# EAGLE design ESPRobotCar (EAGLE 9.6.2)
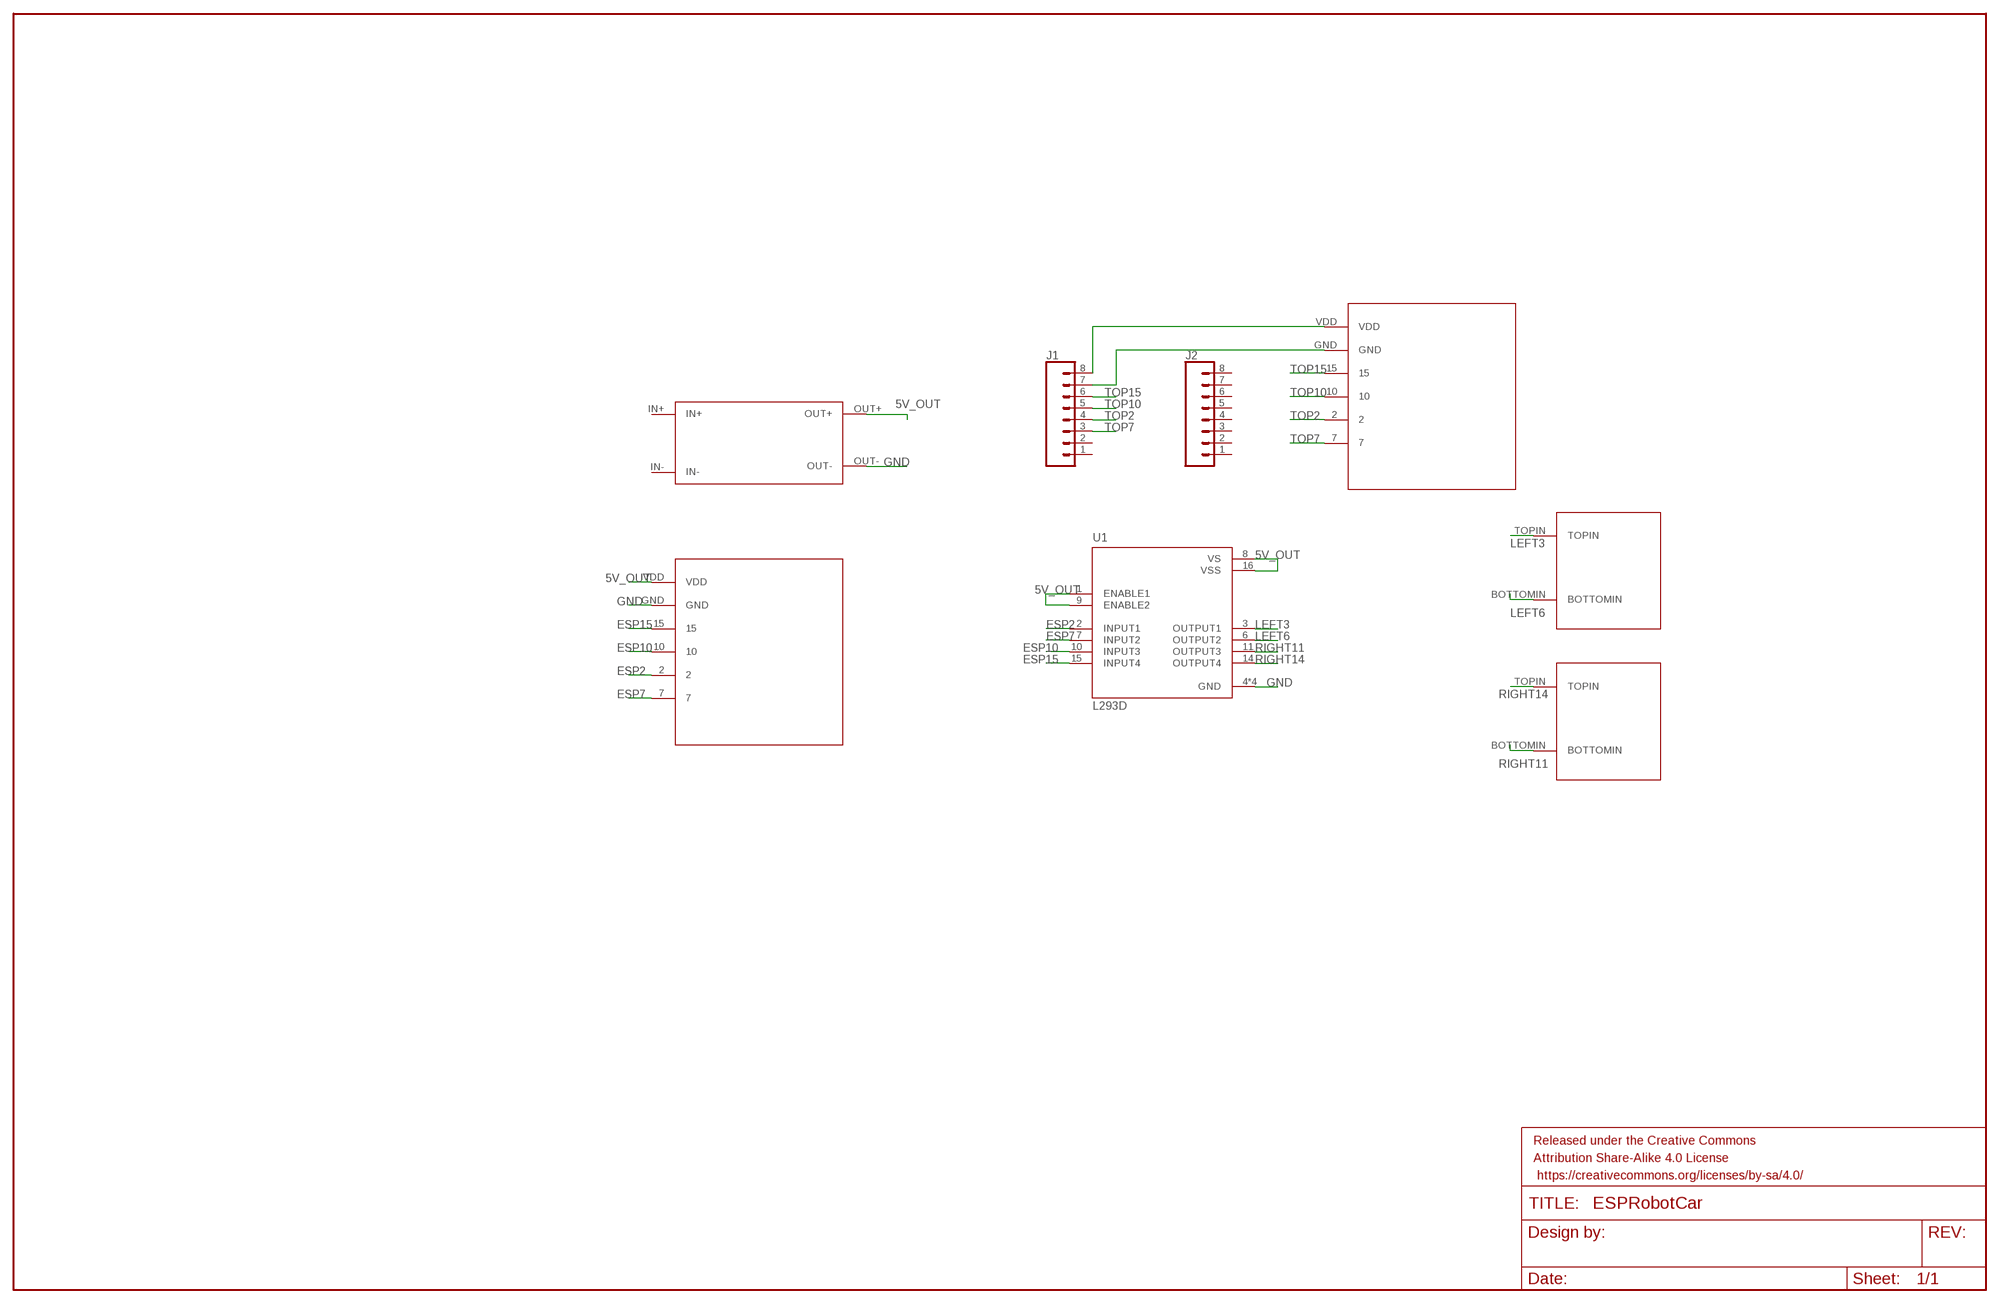
[diagram p0: schematic, sheet 1]

## Parts
FRAME1  FRAME-LEDGER  [CREATIVE_COMMONS]
J1  CONN_08"  [1X08]
J2  CONN_08"  [1X08]
U1  L293D  [DIP880W50P254L2000H510Q16]
U$1  DC_TO_DC  [DCTODC]
U$2  MOTORPAD  [MOTORPAD]
U$3  MOTORPAD  [MOTORPAD]
U$4  MOTORBREAK  [MOTORBREAK]
U$5  MOTORBREAK  [MOTORBREAK]

## Nets
5V_OUT: U1.1(ENABLE1) U1.8(VS) U1.9(ENABLE2) U1.16(VSS) U$1.OUT+ U$4.VDD
ESP2: U1.2(INPUT1) U$4.2
ESP7: U1.7(INPUT2) U$4.7
ESP10: U1.10(INPUT3) U$4.10
ESP15: U1.15(INPUT4) U$4.15
GND: U1.4(GND) U1.5(GND) U1.12(GND) U1.13(GND) U$1.OUT- U$4.GND
LEFT3: U1.3(OUTPUT1) U$2.TOPIN
LEFT6: U1.6(OUTPUT2) U$2.BOTTOMIN
N$1: J1.8 U$5.VDD
N$2: J1.7 U$5.GND
RIGHT11: U1.11(OUTPUT3) U$3.BOTTOMIN
RIGHT14: U1.14(OUTPUT4) U$3.TOPIN
TOP2: J1.4 U$5.2
TOP7: J1.3 U$5.7
TOP10: J1.5 U$5.10
TOP15: J1.6 U$5.15
Unconnected: J1.1 J1.2 J2.1 J2.2 J2.3 J2.4 J2.5 J2.6 J2.7 J2.8 U$1.IN+ U$1.IN-

## Library data of the parts
FRAME1 = SparkFun-Aesthetics:FRAME-LEDGER: Schematic Frame - Ledger Standard 11x14 US Ledger frame
J1 J2 = SparkFun-Connectors:CONN_08: Multi connection point. Often used as Generic Header-pin footprint for 0.1 inch spaced/style header connections On any of the 0.1 inch spaced packages, you can populate with these: Break Away Headers - Straight <https://www.sparkfun.com/products/116> (PRT-00116) Break Away Male Headers - Right Angle <https://www.sparkfun.com/products/553> (PRT-00553) Female Headers <https://www.sparkfun.com/products/115> (PRT-00115) Break Away Headers - Machine Pin <https://www.sparkfun.com/products/117> (PRT-00117) Break Away Female Headers - Swiss Machine Pin <https://www.sparkfun.com/products/743> (PRT-00743) Arduino Stackable Header - 8 Pin <https://www.sparkfun.com/products/9279> (PRT-09279) For SCREWTERMINALS and SPRING TERMINALS visit here: Screw Terimnals on SparkFun.com <https://www.sparkfun.com/search/results?term=Screw+Terminals> (5mm/3.5mm/2.54mm spacing) This device is also useful as a general connection point to wire up your design to another part of your project. Our various solder wires solder well into these plated through hole pads. Hook-Up Wire - Assortment (Stranded, 22 AWG) <https://www.sparkfun.com/products/11375> (PRT-11375) Hook-Up Wire - Assortment (Solid Core, 22 AWG) <https://www.sparkfun.com/products/11367> (PRT-11367) View the entire wire category on our website here <https://www.sparkfun.com/categories/141> Special notes: Molex polarized connector foot print use with SKU : PRT-08231 with associated crimp pins and housings. 1MM SMD Version SKU: PRT-10208 NOTES ON THE VARIANTS LOCK and LOCK_LONGPADS... This footprint was designed to help hold the alignment of a through-hole component (i.e. 6-pin header) while soldering it into place. You may notice that each hole has been shifted either up or down by 0.005 of an inch from it's more standard position (which is a perfectly straight line). This slight alteration caused the pins (the squares in the middle) to touch the edges of the holes. Because they are alternating, it causes a "brace" to hold the component in place. 0.005 has proven to be the perfect amount of "off-center" position when using our standard breakaway headers. Although looks a little odd when you look at the bare footprint, once you have a header in there, the alteration is very hard to notice. Also,if you push a header all the way into place, it is covered up entirely on the bottom side.; PROD_ID: CONN-08438
U1 = L293D:L293D: 4-Channel Motor Driver 24V 16-Pin Power PDIP Tube Check availability <https://pricing.snapeda.com/parts/L293D/STMicroelectronics/view-part?ref=eda>; AVAILABILITY: In Stock; CHECK_PRICES: https://www.snapeda.com/parts/L293D/STMicroelectronics/view-part/?ref=eda; DESCRIPTION: Bipolar Motor Driver - Parallel 16-PowerDIP; MF: STMicroelectronics; MP: L293D; PACKAGE: DIP-16 STMicroelectronics; PRICE: None; PURCHASE-URL: https://www.snapeda.com/api/url_track_click_mouser/?unipart_id=3077057&manufacturer=STMicroelectronics&part_name=L293D&search_term=l293d; SNAPEDA_LINK: https://www.snapeda.com/parts/L293D/STMicroelectronics/view-part/?ref=snap
U$1 = SV_DCToDC:DC_TO_DC
U$2 U$3 = SV_MOTOR:MOTORPAD
U$4 U$5 = SV_MOTOR:MOTORBREAK

## Board
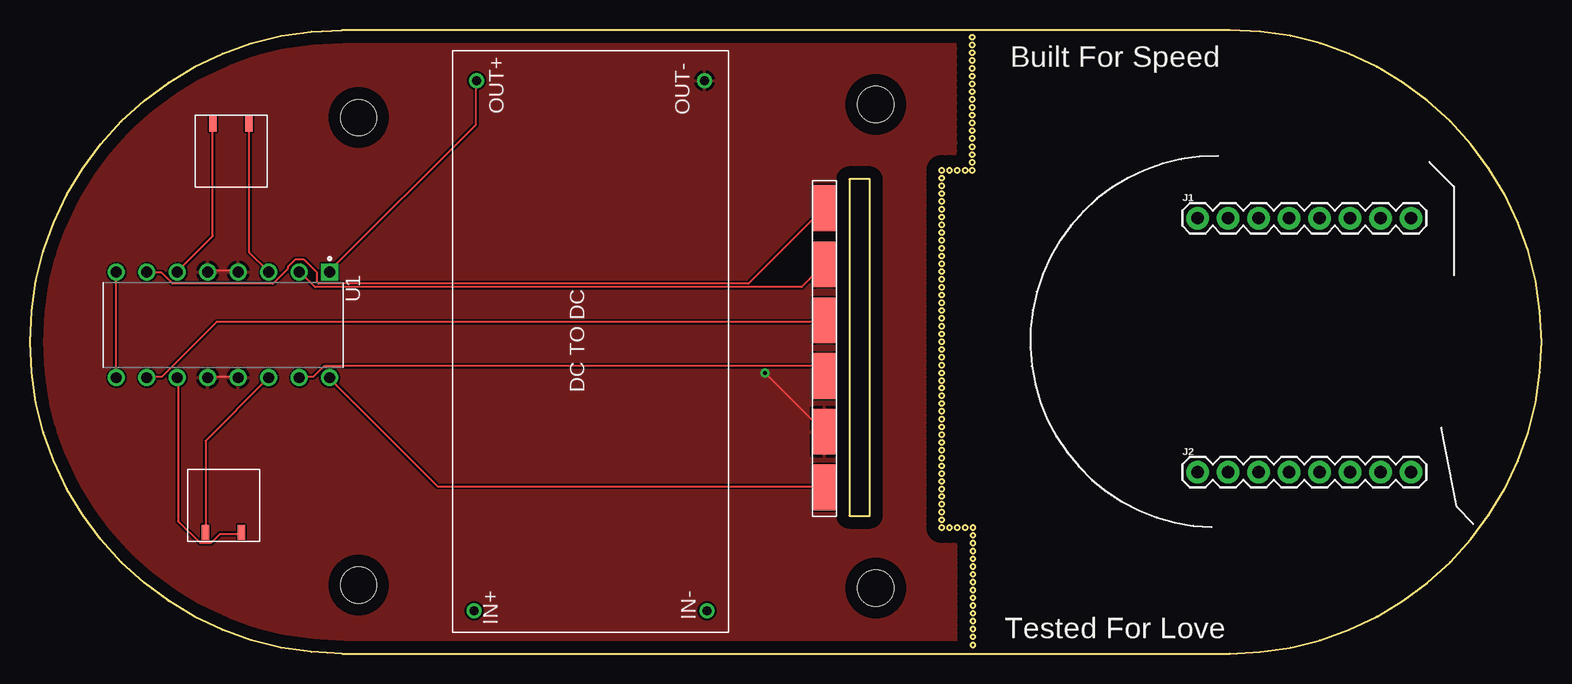
[diagram p1: board, top side]
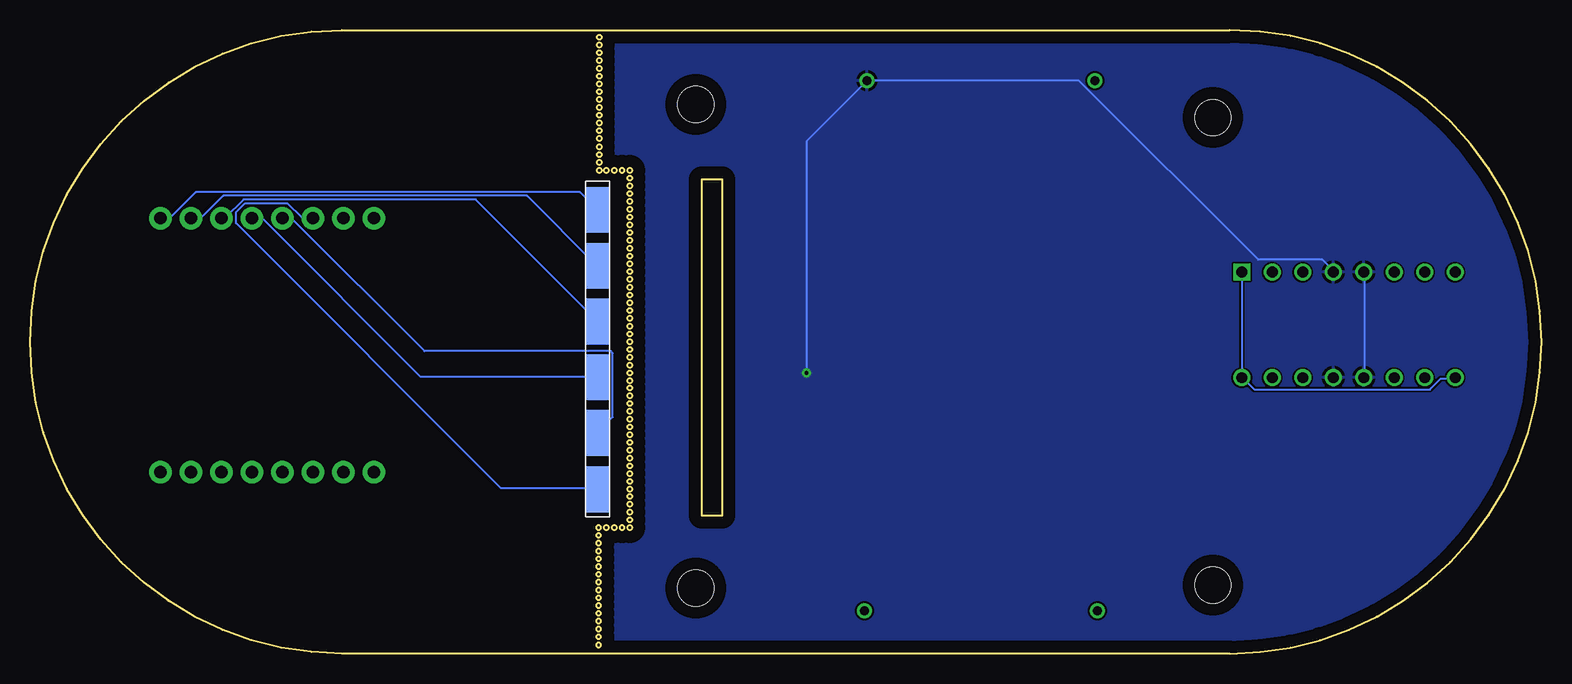
[diagram p2: board, bottom side, seen from below]

Size 126 x 52 mm. Coordinates in mm from the lower left corner, seen from the top.
Outline: 26,0 100,0 arc180 100,52 26,52 arc180 26,0
Outline: 68.3,39.55 68.3,11.5 70,11.5 70,39.55 68.3,39.55
Outline: circle at 76,39.65 radius 0.19
Outline: circle at 76,39 radius 0.19
Outline: circle at 76,38.35 radius 0.19
Outline: circle at 76,37.7 radius 0.19
Outline: circle at 76,37.05 radius 0.19
Outline: circle at 76,36.4 radius 0.19
Outline: circle at 76,35.75 radius 0.19
Outline: circle at 76,35.1 radius 0.19
Outline: circle at 76,34.45 radius 0.19
Outline: circle at 76,33.8 radius 0.19
Outline: circle at 76,33.15 radius 0.19
Outline: circle at 76,32.5 radius 0.19
Outline: circle at 76,31.85 radius 0.19
Outline: circle at 76,40.3 radius 0.19
Outline: circle at 76.65,40.3 radius 0.19
Outline: circle at 77.3,40.3 radius 0.19
Outline: circle at 77.95,40.3 radius 0.19
Outline: circle at 78.55,40.3 radius 0.19
Outline: circle at 78.55,40.95 radius 0.19
Outline: circle at 78.55,41.6 radius 0.19
Copper layers (1*16): Top 0.035mm / dielectric 1.5mm / Bottom 0.035mm
Design rules "default": minimum track width 6mil, minimum drill 0.35mm, track to track 6mil, track to pad 6mil, pad to pad 6mil, via to via 6mil, smd to smd 6mil, copper to edge 40mil, drill to drill 6mil, minimum pad ring 10mil, minimum via ring 8mil, stop-mask expansion 4mil, vias tented up to drill 0mil, thermal gap 10mil
Holes 3 mm at 27.4,5.7 27.4,44.7 70.5,45.8 70.5,5.45

### Footprints (pad centres in the part's own frame; a part is rotated, then mirrored left to right if it is on the bottom)
1X08 = drill 1.016 pad 1.88: 1 0,0; 2 2.54,0; 3 5.08,0; 4 7.62,0; 5 10.16,0; 6 12.7,0; 7 15.24,0; 8 17.78,0
DIP880W50P254L2000H510Q16 = drill 0.9 pad 1.25 square: 1 -4.4,8.89 | drill 0.9 pad 1.25: 2 -4.4,6.35; 3 -4.4,3.81; 4 -4.4,1.27; 5 -4.4,-1.27; 6 -4.4,-3.81; 7 -4.4,-6.35; 8 -4.4,-8.89; 9 4.4,-8.89; 10 4.4,-6.35; 11 4.4,-3.81; 12 4.4,-1.27; 13 4.4,1.27; 14 4.4,3.81; 15 4.4,6.35; 16 4.4,8.89
DCTODC = drill 0.75: IN+ 1.8,21.2; IN- 1.8,1.8; OUT+ 46,21; OUT- 46,2
MOTORPAD = smd 1.27 x 0.635: BOTTOMIN 0.75,1.5; TOPIN 0.75,4.5
MOTORBREAK = smd 3.81 x 1.93: 2 7,1; 7 2.3,1; 10 11.65,1; 15 16.3,1; GND 20.95,1; VDD 25.6,1

### Placement (x,y rotation side)
FRAME1  -51.51,78.3 0 top  (outside the outline)
J1  97.34,36.31 0 top
J2  97.34,15.13 0 top
U1  16.09,27.41 270 top
U$1  58.23,1.77 90 top
U$2  13.76,44.91 270 top
U$3  19.13,9.36 90 top
U$4  65.21,39.45 270 top
U$5  77.69,11.39 90 bottom

### Tracks (layer width: path | path; a pad name or v marks a point on that pad's centre or on a via)
5V_OUT
  Top 0.152: U1.9 7.16,23.08 7.16,31.77 U1.8 | U$1.OUT+ 37.19,47.77 37.19,44.11 25,31.92 U1.1 | U$4.VDD 66.14,13.94 33.99,13.94 25,22.93 U1.16
  Bottom 0.152: U1.1 25,31.77 25,23.08 U1.16 24.84,22.93 23.93,22.01 9.3,22.01 8.38,22.93 7.32,22.93 U1.9
ESP2
  Top 0.152: U1.2 22.56,31.77 23.78,30.55 64.31,30.55 66.14,32.38 U$4.2
ESP7
  Top 0.152: U1.7 9.75,31.77 10.97,31.77 11.89,30.85 20.27,30.85 21.49,32.07 21.49,32.22 22.1,32.83 22.86,32.83 23.93,31.77 23.93,31 24.08,30.85 59.89,30.85 66.14,37.1 U$4.7
ESP10
  Top 0.152: U1.10 9.75,23.08 10.97,23.08 15.55,27.65 66.14,27.65 U$4.10
ESP15
  Top 0.152: U1.15 22.56,23.08 23.62,23.08 24.54,24 65.38,24 66.14,23.23 U$4.15
GND  (via drill 0.35)
  Top 0.152: U1.12 14.94,23.08 17.22,23.08 U1.13 | U1.5 14.94,31.92 17.22,31.92 U1.4 | v61.27,23.38 66.14,18.51 U$4.GND
  Bottom 0.152: U1.4 17.38,31.92 18.29,32.83 23.62,32.83 38.56,47.77 56.08,47.77 U$1.OUT- 61.27,42.74 v61.27,23.38 | U1.12 14.78,23.08 14.78,31.77 U1.5
  pour Top: 25.15,52 101.95,52 102.05,51.9 103.1,51.9 103.15,51.85 103.5,51.85 103.65,51.7 104.55,51.7 104.7,51.55 105.2,51.55 105.3,51.45 105.55,51.45 105.7,51.3 106.25,51.3 106.35,51.2 106.55,51.2 106.7,51.05 107.15,51.05 107.25,50.95 107.6,50.95 107.8,50.75 108.2,50.75 108.45,50.5 108.8,50.5 109,50.3 109.4,50.3 109.6,50.1 109.9,50.1 110.15,49.85 110.5,49.85 110.7,49.65 110.95,49.65 111.2,49.4 111.5,49.4 111.7,49.2 111.95,49.2 112.25,48.9 112.45,48.9 112.75,48.6 112.95,48.6 113.25,48.3 113.5,48.3 113.9,47.9 114.1,47.9 114.4,47.6 114.65,47.6 115.15,47.1 115.3,47.1 115.85,46.55 116.05,46.55 116.65,45.95 116.8,45.95 118.85,43.9 119.45,43.3 119.45,43.1 120.55,42 120.55,41.85 121.45,40.95 121.45,40.6 122.05,40 122.05,39.7 122.55,39.2 122.55,38.9 123,38.45 123,38 123.4,37.6 123.4,37.3 123.7,37 123.7,36.6 124.1,36.2 124.1,35.75 124.4,35.45 124.4,34.95 124.75,34.6 124.75,33.95 125,33.7 125,33.05 125.25,32.8 125.25,32.05 125.45,31.85 125.45,31.1 125.65,30.9 125.65,30.1 125.85,29.9 125.85,28.8 125.95,28.7 125.95,27.1 126,27.05 126,25 126,24.05 125.9,23.95 125.9,23.3 125.85,23.25 125.8,23.2 125.8,22.55 125.7,22.45 125.7,21.95 125.6,21.85 125.6,21.3 125.5,21.2 125.5,20.8 125.35,20.65 125.35,20.15 125.2,20 125.2,19.55 125.05,19.4 125.05,19 124.9,18.85 124.9,18.45 124.75,18.3 124.75,18 124.6,17.85 124.6,17.5 124.45,17.35 124.45,17.1 124.3,16.95 124.3,16.7 124.15,16.55 124.15,16.4 124,16.25 124,16.05 123.85,15.9 123.85,15.65 123.65,15.45 123.65,15.2 123.45,15 123.45,14.75 123.2,14.5 123.2,14.25 122.95,14 122.95,13.75 122.65,13.45 122.65,13.25 122.4,13 122.4,12.75 122.05,12.4 122.05,12.15 121.75,11.85 121.75,11.7 121.4,11.35 121.4,11.2 121,10.8 121,10.6 120.6,10.2 120.6,10.1 119.8,9.3 119.8,9.1 118.95,8.25 118.95,8.2 118.1,7.35 116.9,6.15 116.7,6.15 115.7,5.15 115.5,5.15 114.65,4.3 114.3,4.3 113.75,3.75 113.45,3.75 113,3.3 112.7,3.3 112.3,2.9 111.9,2.9 111.6,2.6 111.3,2.6 110.95,2.25 110.6,2.25 110.35,2 109.95,2 109.7,1.75 109.35,1.75 109.15,1.55 108.75,1.55 108.5,1.3 108.1,1.3 107.95,1.15 107.6,1.15 107.35,0.9 106.75,0.9 106.6,0.75 106.1,0.75 105.95,0.6 105.5,0.6 105.3,0.4 104.4,0.4 104.25,0.25 103.55,0.25 103.3,0 100.85,0 24,0 23.9,0.1 22.2,0.1 21.95,0.35 20.5,0.35 20.2,0.65 19.55,0.65 19.35,0.85 18.75,0.85 18.5,1.1 17.9,1.1 17.6,1.4 17.05,1.4 16.7,1.75 16.15,1.75 15.85,2.05 15.4,2.05 15.05,2.4 14.5,2.4 14.05,2.85 13.75,2.85 13.3,3.3 12.95,3.3 12.4,3.85 12,3.85 11.25,4.6 10.95,4.6 10.1,5.45 9.85,5.45 6.75,8.55 6,9.3 6,9.45 5.3,10.15 5.3,10.3 4.6,11 4.6,11.25 4,11.85 4,12.15 3.4,12.75 3.4,13.15 3,13.55 3,13.95 2.55,14.4 2.55,14.85 2.15,15.25 2.15,15.7 1.95,15.9 1.95,16.2 1.7,16.45 1.7,16.75 1.5,16.95 1.5,17.3 1.35,17.45 1.35,17.85 1.15,18.05 1.15,18.35 1,18.5 1,18.95 0.8,19.15 0.8,19.5 0.65,19.65 0.65,20.25 0.5,20.4 0.5,21 0.35,21.15 0.35,21.9 0.2,22.05 0.2,22.85 0.05,23 0.05,24.05 0.05,28.55 0.1,28.6 0.1,29.4 0.25,29.55 0.25,30.8 0.5,31.05 0.5,31.75 0.7,31.95 0.7,32.75 0.95,33 0.95,33.6 1.25,33.9 1.25,34.35 1.45,34.55 1.45,35 1.7,35.25 1.7,35.75 2.05,36.1 2.05,36.55 2.4,36.9 2.4,37.3 2.8,37.7 2.8,38.15 3.3,38.65 3.3,39.1 3.95,39.75 3.95,40.15 4.8,41 4.8,41.5 6.45,43.15 9.4,46.1 9.6,46.1 10.6,47.1 10.75,47.1 11.35,47.7 11.7,47.7 12.25,48.25 12.55,48.25 13.1,48.8 13.6,48.8 14.15,49.35 14.7,49.35 15.25,49.9 15.85,49.9 16.2,50.25 16.65,50.25 17.05,50.65 17.75,50.65 18,50.9 18.6,50.9 18.85,51.15 19.35,51.15 19.65,51.45 20.7,51.45 21,51.75 22.4,51.75 22.65,52
  pour Bottom: 25.25,52.05 100.75,52.05 100.85,51.95 102.55,51.95 102.6,51.9 103.45,51.9 103.65,51.7 104.75,51.7 105.1,51.35 106.4,51.35 106.7,51.05 107.1,51.05 107.45,51.05 107.75,50.75 108.4,50.75 108.65,50.5 109.2,50.5 109.55,50.15 110.1,50.15 110.6,49.65 111.15,49.65 111.55,49.25 112,49.25 112.5,48.75 113,48.75 113.55,48.2 113.9,48.2 114.7,47.4 115,47.4 115.7,46.7 116.05,46.7 117.7,45.05 119.75,43 119.75,42.85 121.05,41.55 121.05,41.25 121.7,40.6 121.7,40.3 122.25,39.75 122.25,39.4 122.75,38.9 122.75,38.6 123.15,38.2 123.15,37.85 123.45,37.55 123.45,37.15 123.85,36.75 123.85,36.35 124.2,36 124.2,35.5 124.4,35.3 124.4,34.85 124.65,34.6 124.65,34.2 124.9,33.95 124.9,33.45 125.1,33.25 125.1,32.6 125.35,32.35 125.35,31.55 125.65,31.25 125.65,30.05 125.85,29.85 125.85,28.1 126,27.95 126,25.1 126,23.5 125.9,23.4 125.9,22.6 125.75,22.45 125.65,22.35 125.65,21.8 125.5,21.65 125.5,20.85 125.4,20.75 125.4,20.2 125.15,19.95 125.15,19.35 124.9,19.1 124.9,18.4 124.9,17.95 124.6,17.65 124.6,17.05 124.25,16.7 124.25,16.15 123.9,15.8 123.9,15.25 123.5,14.85 123.5,14.5 123.1,14.1 123.1,13.7 122.65,13.25 122.65,12.9 122.05,12.3 122.05,11.95 121.55,11.45 121.55,11.15 120.75,10.35 120.75,10.1 119.85,9.2 116.15,5.5 116,5.5 115.25,4.75 114.95,4.75 114.3,4.1 114,4.1 113.45,3.55 113.05,3.55 112.45,2.95 112.1,2.95 111.6,2.45 111,2.45 110.6,2.05 109.95,2.05 109.6,1.7 109.1,1.7 108.7,1.3 108.05,1.3 107.65,0.9 106.85,0.9 106.6,0.65 105.8,0.65 105.6,0.45 104.75,0.45 104.6,0.3 103.65,0.3 103.5,0.15 102.45,0.15 102.35,0.05 25.35,0.05 23,0.05 22.85,0.2 21.05,0.2 20.6,0.65 19.4,0.65 18.95,1.1 17.65,1.1 17.15,1.6 16.5,1.6 16,2.1 15.2,2.1 14.5,2.8 13.9,2.8 13.5,3.2 13.05,3.2 12.4,3.85 11.95,3.85 11,4.8 10.55,4.8 9.15,6.2 5.2,10.15 5.2,10.4 4,11.6 4,12.15 3.65,12.5 3.65,12.8 3.15,13.3 3.15,13.55 2.7,14 2.7,14.55 2.3,14.95 2.3,15.4 1.8,15.9 1.8,16.55 1.45,16.9 1.45,17.65 1.05,18.05 1.05,18.9 0.55,19.4 0.55,20.8 0.2,21.15 0.2,23.15 0.05,23.3 0.05,25.35 0.05,28.75 0.25,28.95 0.25,30.65 0.45,30.85 0.45,31.9 0.85,32.3 0.85,33.55 1.3,34 1.3,34.9 1.8,35.4 1.8,36.4 2.5,37.1 2.5,37.85 3.3,38.65 3.3,39.15 4.05,39.9 4.05,40.45 5.25,41.65 5.25,42 7.45,44.2 10.45,47.2 10.9,47.2 12.25,48.55 13,48.55 13.65,49.2 14.35,49.2 15.05,49.9 15.85,49.9 16.4,50.45 17.25,50.45 17.75,50.95 18.7,50.95 19.05,51.3 20.1,51.3 20.4,51.6 21.55,51.6 21.8,51.85 23.2,51.85 23.4,52.05
LEFT3
  Top 0.152: U$2.TOPIN 18.29,44.11 18.29,33.44 19.81,31.92 U1.3
LEFT6
  Top 0.152: U$2.BOTTOMIN 15.24,44.11 15.24,34.81 12.35,31.92 U1.6
N$1
  Bottom 0.152: J1.8 115.06,36.34 114.3,36.34 112.17,38.47 80.16,38.47 78.79,37.1 U$5.VDD
N$2
  Bottom 0.152: J1.7 112.47,36.34 111.71,36.34 109.88,38.17 84.58,38.17 78.79,32.38 U$5.GND
RIGHT11
  Top 0.152: U$3.BOTTOMIN 17.53,9.97 15.85,9.97 15.09,9.21 14.17,9.21 12.35,11.04 12.35,22.93 U1.11
RIGHT14
  Top 0.152: U$3.TOPIN 14.63,10.13 14.63,17.75 19.81,22.93 U1.14
TOP2
  Bottom 0.152: J1.4 104.85,36.19 104.09,36.19 93.12,25.21 77.57,25.21 77.42,25.06 77.42,19.73 78.64,18.51 U$5.2
TOP7
  Bottom 0.152: J1.3 102.57,36.34 103.33,36.34 104.55,37.56 108.05,37.56 108.81,36.8 108.81,35.88 86.72,13.78 78.79,13.78 U$5.7
TOP10
  Bottom 0.152: J1.5 107.44,36.19 106.53,36.19 93.42,23.08 78.79,23.08 U$5.10
TOP15
  Bottom 0.152: J1.6 110.03,36.34 109.73,36.34 108.2,37.86 88.85,37.86 78.79,27.8 U$5.15

### Text on the board
tPlace: Built For Speed | Tested For Love